# Altium schematic sheet MAC.SchDoc: Grandmaster MAC & Clock Generation
size Tabloid; Author: N Smith; Revision: A; SheetNumber: 6; SheetTotal: 7; Customer: 01910
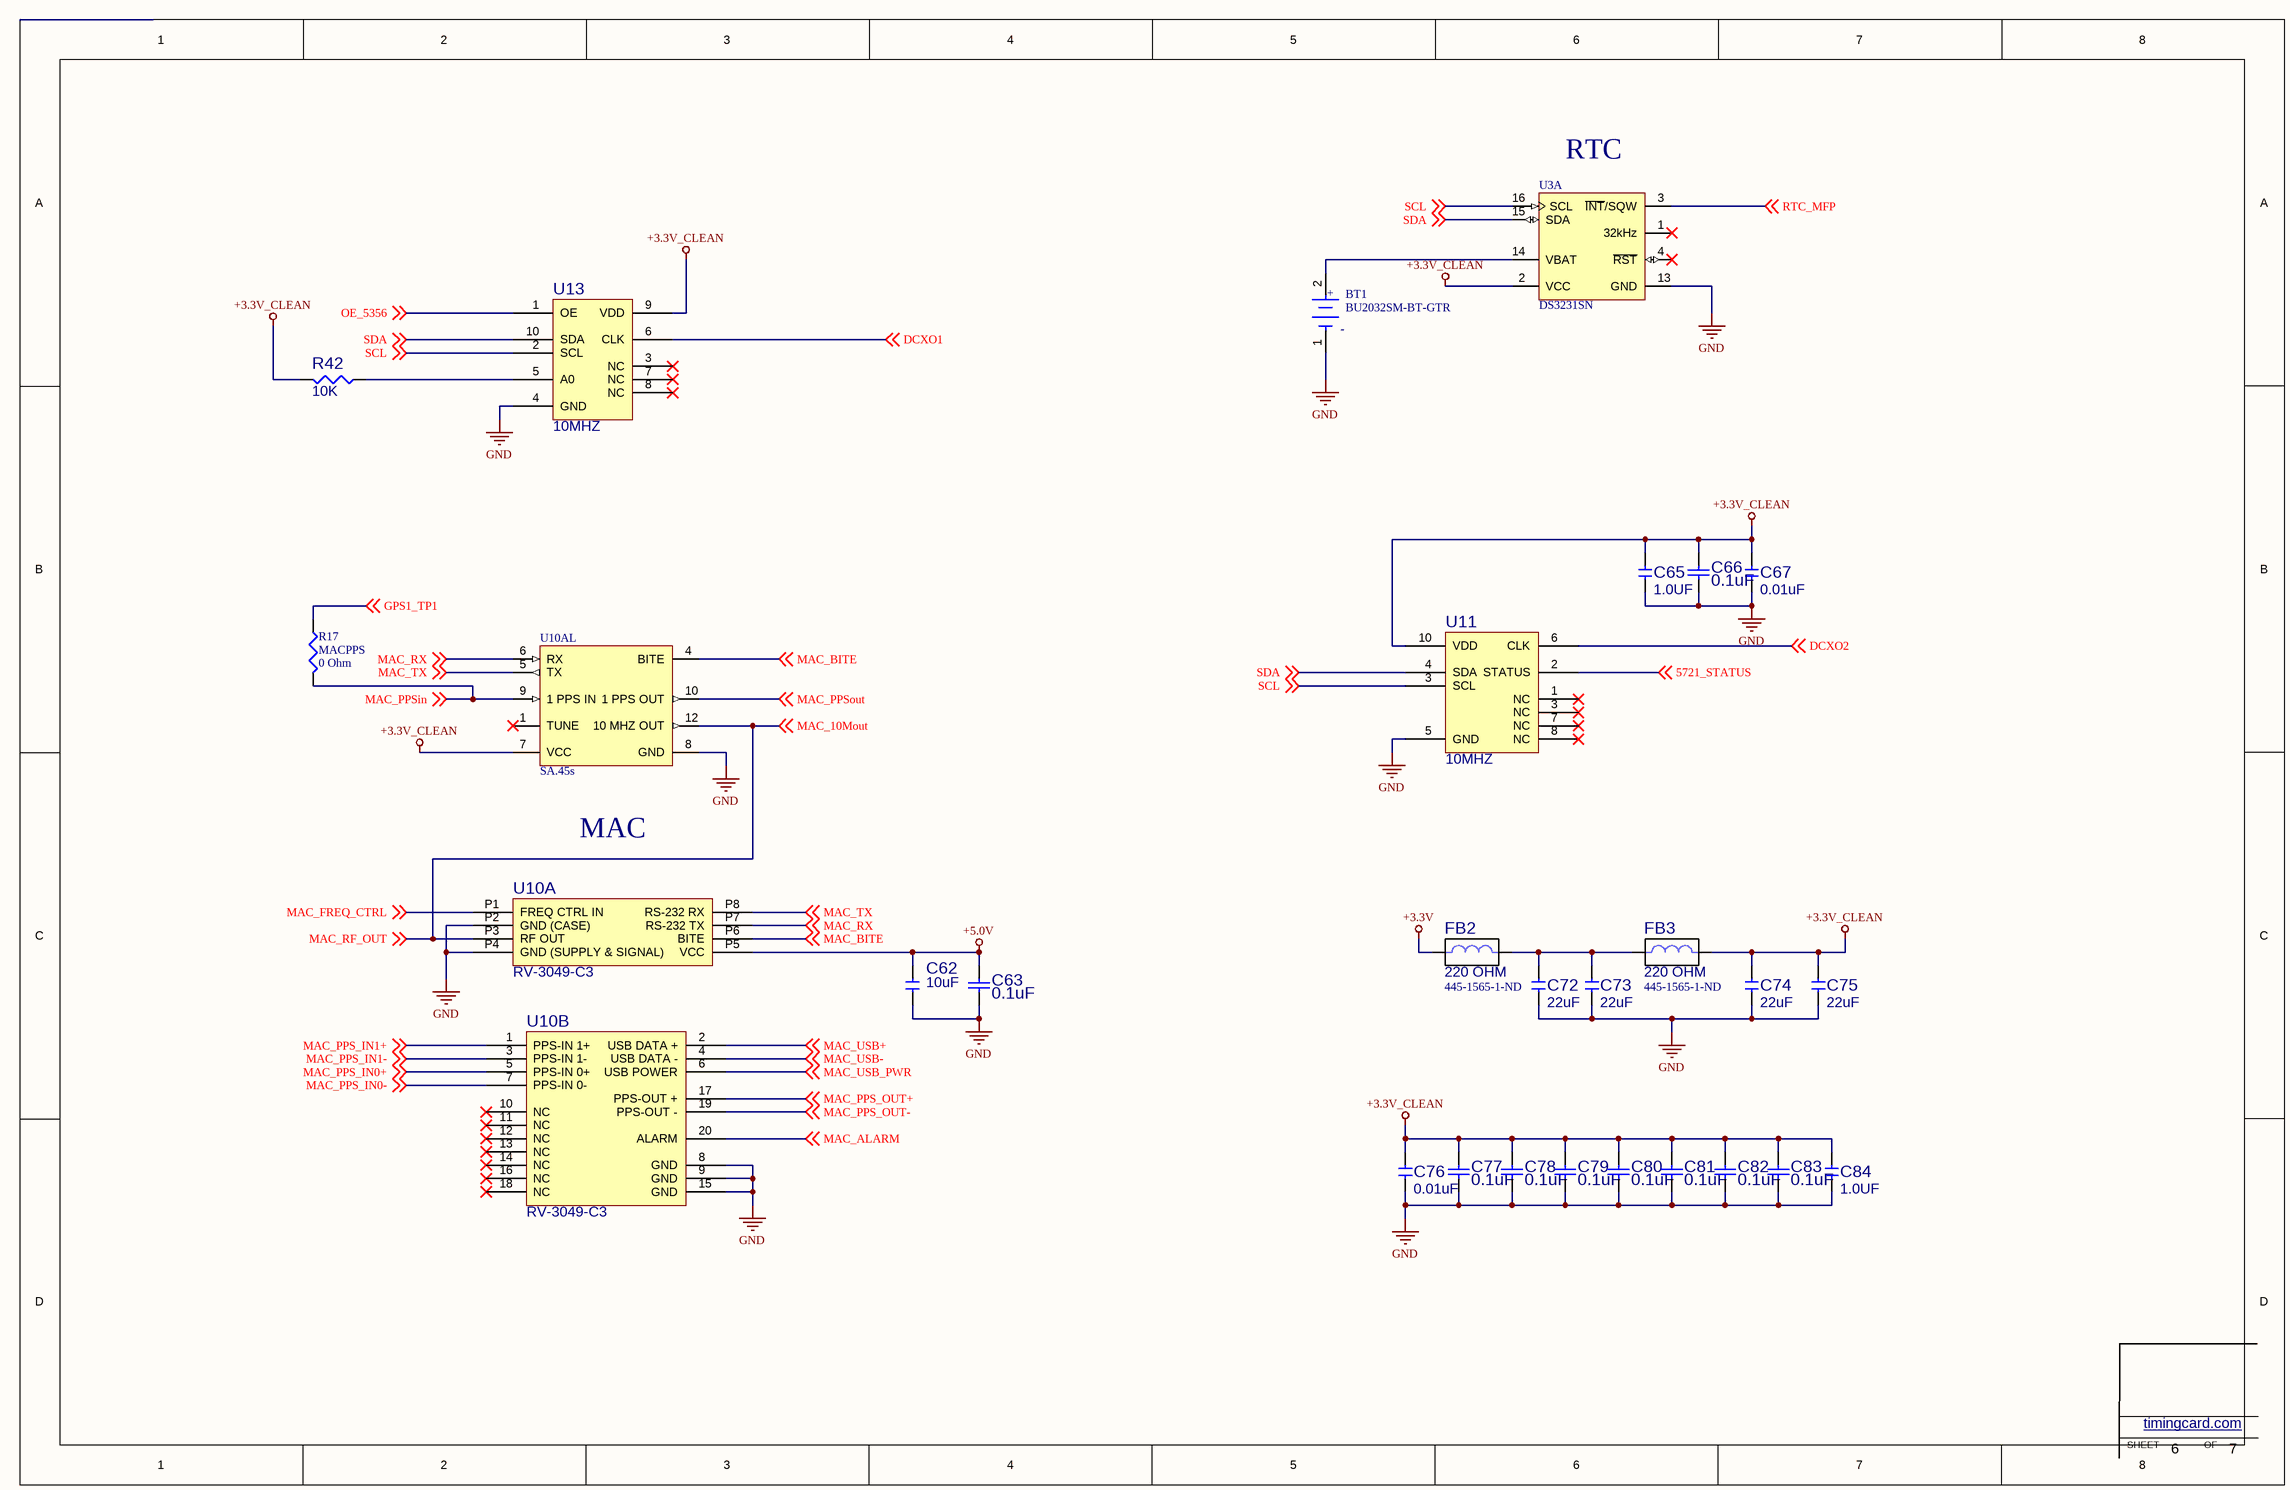
[diagram p0: MAC.SchDoc]

## Parts
BT1  BU2032SM-BT-GTR  [FP-BU2032SM-BT-GTR-MFG]
C62  value 10uF  [CAPC2012X14N]  (hidden comment: CAP_0805_10UF_25V)
C63  0.1uF  [CAPC1608X87X45ML20T05]
C65  value 1.0UF  [CAPC2012X14N]  (hidden comment: CAP_0805_1UF_50V)
C66  0.1uF  [CAPC1608X87X45ML20T05]
C67  value 0.01uF  [CAPC1608X10N]  (hidden comment: CAP_0603_0.01UF_50V)
C72  value 22uF  [CAPC2012X14N]  (hidden comment: CAP_0805_22UF_16V)
C73  value 22uF  [CAPC2012X14N]  (hidden comment: CAP_0805_22UF_16V)
C74  value 22uF  [CAPC2012X14N]  (hidden comment: CAP_0805_22UF_16V)
C75  value 22uF  [CAPC2012X14N]  (hidden comment: CAP_0805_22UF_16V)
C76  value 0.01uF  [CAPC1608X10N]  (hidden comment: CAP_0603_0.01UF_50V)
C77  0.1uF  [CAPC1608X87X45ML20T05]
C78  0.1uF  [CAPC1608X87X45ML20T05]
C79  0.1uF  [CAPC1608X87X45ML20T05]
C80  0.1uF  [CAPC1608X87X45ML20T05]
C81  0.1uF  [CAPC1608X87X45ML20T05]
C82  0.1uF  [CAPC1608X87X45ML20T05]
C83  0.1uF  [CAPC1608X87X45ML20T05]
C84  value 1.0UF  [CAPC2012X14N]  (hidden comment: CAP_0805_1UF_50V)
FB2  value 220 OHM  Supplier Part Number 1: 445-1565-1-ND  [INDC1608X09N]  (hidden comment: MPZ1608_220OHM_0603)
FB3  value 220 OHM  Supplier Part Number 1: 445-1565-1-ND  [INDC1608X09N]  (hidden comment: MPZ1608_220OHM_0603)
R17  MACPPS  value 0 Ohm  [J1-0603]
R42  value 10K  [RESC1608X50N]  (hidden comment: ERJ-3EKF1002V)
U3  DS3231SN  [W16-H2_L]  (part A of 2)
U10  value RV-3049-C3  [MAC-SA5X]  (hidden comment: MAC-SA5X)  (parts A,B of 2)
U10AL  SA.45s  [MCSM-090-02984-00X]
U11  value 10MHZ  [SIT5721]  (hidden comment: SiT5721AI-KWA33-T-10.000000)
U13  value 10MHZ  [SIT5155]  (hidden comment: SiT5356AI-FQA33-IT-10.000000)

## Nets
+3.3V: FB2.1
+3.3V_CLEAN: C65.2 C66.2 C67.2 C74.2 C75.2 C76.2 C77.2 C78.2 C79.2 C80.2 C81.2 C82.2 C83.2 C84.2 FB3.2 R42.2 U3.2(VCC) U10AL.7(VCC) U11.10(VDD) U13.9(VDD)
+5.0V: C62.1 C63.2 U10.P5(VCC)
GND: BT1.1(C) C62.2 C63.1 C65.1 C66.1 C67.1 C72.1 C73.1 C74.1 C75.1 C76.1 C77.1 C78.1 C79.1 C80.1 C81.1 C82.1 C83.1 C84.1 U3.13(GND) U10.8(GND) U10.9(GND) U10.15(GND) U10.P2(GND_(CASE)) U10.P4(GND_(SUPPLY_&_SIGNAL)) U10AL.8(GND) U11.5(GND) U13.4(GND)
5721_STATUS: U11.2(STATUS) ; off-sheet 5721_STATUS
DCXO1: U13.6(CLK) ; off-sheet DCXO1
DCXO2: U11.6(CLK) ; off-sheet DCXO2
GPS1_TP1: R17.1 ; off-sheet GPS1_TP1
MAC_10Mout: U10.P3(RF_OUT) U10AL.12(10_MHZ_OUT) ; off-sheet MAC_RF_OUT, off-sheet MAC_10Mout  [also labelled MAC_RF_OUT]
MAC_ALARM: U10.20(ALARM) ; off-sheet MAC_ALARM
MAC_BITE: U10.P6(BITE) U10AL.4(BITE) ; off-sheet MAC_BITE
MAC_FREQ_CTRL: U10.P1(FREQ_CTRL_IN) ; off-sheet MAC_FREQ_CTRL
MAC_PPS_IN0+: U10.5(PPS-IN_0+) ; off-sheet MAC_PPS_IN0+
MAC_PPS_IN0-: U10.7(PPS-IN_0-) ; off-sheet MAC_PPS_IN0-
MAC_PPS_IN1+: U10.1(PPS-IN_1+) ; off-sheet MAC_PPS_IN1+
MAC_PPS_IN1-: U10.3(PPS-IN_1-) ; off-sheet MAC_PPS_IN1-
MAC_PPS_OUT+: U10.17(PPS-OUT_+) ; off-sheet MAC_PPS_OUT+
MAC_PPS_OUT-: U10.19(PPS-OUT_-) ; off-sheet MAC_PPS_OUT-
MAC_PPSin: R17.2 U10AL.9(1_PPS_IN) ; off-sheet MAC_PPSin
MAC_PPSout: U10AL.10(1_PPS_OUT) ; off-sheet MAC_PPSout
MAC_RX: U10.P7(RS-232_TX) U10AL.6(RX) ; off-sheet MAC_RX
MAC_TX: U10.P8(RS-232_RX) U10AL.5(TX) ; off-sheet MAC_TX
MAC_USB+: U10.2(USB_DATA_+) ; off-sheet MAC_USB+
MAC_USB-: U10.4(USB_DATA_-) ; off-sheet MAC_USB-
MAC_USB_PWR: U10.6(USB_POWER) ; off-sheet MAC_USB_PWR
OE_5356: U13.1(OE) ; off-sheet OE_5356
RTC_MFP: U3.3(~{INT}/SQW) ; off-sheet RTC_MFP
SCL: U3.16(SCL) U11.3(SCL) U13.2(SCL) ; off-sheet SCL
SDA: U3.15(SDA) U11.4(SDA) U13.10(SDA) ; off-sheet SDA
NetBT1_2: BT1.2(A) U3.14(VBAT)
NetC72_2: C72.2 C73.2 FB2.2 FB3.1
NetR42_1: R42.1 U13.5(A0)

Not connected (* = marked no-connect by the designer): U3 1(32kHz)* 4(~{RST})*; U10 10(NC)* 11(NC)* 12(NC)* 13(NC)* 14(NC)* 16(NC)* 18(NC)*; U10AL 1(TUNE)*; U11 1(NC)* 7(NC)* 8(NC)*; U13 3(NC)* 7(NC)* 8(NC)*

## Notes on the sheet
- (near U3) RTC
- MAC
- SHEET
- timingcard.com <http://timingcard.com>
- OF
- (in symbol CMP-136216-000002-1) +; -

## Library data of the parts
BT1 = CMP-136216-000002-1: BATTERY HOLDER COIN 20MM SMD; Number of Cells: 1; Termination: SMD/SMT; Mount: Surface Mount; Max Operating Temperature: 280°C; Min Operating Temperature: -40°C; Package Quantity: 400; Case/Package: SMD/SMT
C62 = CAP_0805_10UF_25V: CAP, CER, 10.UF, 25V, 10%, X5R, 0805; MFG PART NUM: TMK212BBJ106KG-T; VALENTIUM PART NUM: <VALENTIUM>; MFG NAME: TAIYO YUDEN; MAXTEMP: 85C; MINTEMP: -55C; DESC: CAP, CER, 10.UF, 10V, 10%, X5R, 0805; MODIFY DATE: 10/23/2013; CATEGORY: CAP, CER; Date: 4/11/2006 3:37:28 PM; SHEETPART: *; P1: 10%; P2: 25V; P3: X5R; Size: 0805; Supplier 1: MOUSER; Supplier Part Number 1: 963-TMK212BBJ106KG-T
C63 C66 C77-C83 = CMP-2006-00003-1: C0603X104K5RACAUTO; Manufacturer: Kemet; Part Number: C0603X104K5RACAUTO
C65 C84 = CAP_0805_1UF_50V: CAP, CER, 1.0UF, 50V, 10%, X7R, 0805; MFG PART NUM: GCM21BR71H105KA03L; VALENTIUM PART NUM: <VALENTIUM>; MFG NAME: MURATA; MAXTEMP: 125C; MINTEMP: -55C; OTHER: AEC-Q200; MODIFY DATE: 10/23/2013; CATEGORY: CAP, CER; Date: 10/31/2006 2:46:38 PM; SHEETPART: *; P1: 10%; P2: 50V; P3: X7R; Size: 0805; DESC: CAP, CER, 1.0UF, 50V, 10%, X7R, 0805; Supplier 1: Digi-Key; Supplier Part Number 1: 490-10675-1-ND
C67 C76 = CAP_0603_0.01UF_50V: CAP, CER, 0.01UF, 50V, 10%, X7R, 0603; MFG PART NUM: C0603C103K5RACTU; VALENTIUM PART NUM: <VALENTIUM>; MFG NAME: KEMET; MAXTEMP: 125C; MINTEMP: -55C; CATEGORY: CAP, CER; MODIFY DATE: 10/23/2013; Date: 7/24/2013; SHEETPART: *; P1: 10%; P2: 50V; P3: X7R; Size: 0603; Supplier 1: Digi-Key; Supplier Part Number 1: 399-1091-1-ND; DESC: CAP, CER, 0.01UF, 50V, 10%, X7R, 0603
C72-C75 = CAP_0805_22UF_16V: CAP, CER, 22.UF, 16V, 20%, X5R, 0805; MFG PART NUM: GRM219R61C226ME15L; VALENTIUM PART NUM: <VALENTIUM>; MFG NAME: MURATA; MAXTEMP: 85C; MINTEMP: -55C; MODIFY DATE: 10/23/2013; CATEGORY: CAP, CER; Date: 4/11/2006 3:37:28 PM; SHEETPART: *; P1: 20%; P2: 16V; P3: X5R; Size: 0805; DESC: CAP, CER, 22.UF, 16V, 20%, X5R, 0805; Supplier 1: Digi-Key; Supplier Part Number 1: 490-9952-1-ND
FB2 FB3 = MPZ1608_220OHM_0603: FER, 220 OHM, 100MHZ, 2.2A, 0.05OHM DC, MPZ1608, 0603; MFG PART NUM: MPZ1608S221ATA00; VALENTIUM PART NUM: <VALENTIUM>; MFG NAME: TDK CORP; MAXTEMP: 125C; MINTEMP: -55C; MODIFY DATE: 9/4/2013; CATEGORY: FERRITE; Date: 8/6/2013; P1: 100MHZ; P2: 2.2A; P3: 0.05 OHM; SIZE: 0603; SHEETPART: *; DESC: FER, 220 OHM, 100MHZ, 2.2A, 0.05OHM DC, MPZ1608, 0603; OTHER: MPZ1608; Supplier 1: Digi-Key
R17 = Res3: Resistor; Published: 8-Jun-2000; LatestRevisionDate: 29-May-2009; LatestRevisionNote: IPC-7351 Footprint Added.; PackageReference: J1-0603; Publisher: Altium Limited; PackageDescription: Chip Resistor
R42 = RES_0603_10K: RES, 10K, 1%, 1/10W, TF, 0603; VELENTIUM PART NUM: <VELENTIUM>; MFG NAME: PANASONIC; MAXTEMP: 125C; MINTEMP: -55C; OTHER: 100PPM; SUB: GENERIC; ModifyDate: 7/25/2013; MFG PART NUM: ERJ-3EKF1002V; CATEGORY: RES; Date: 7/26/2013; P1: 1%; P3: TF; P2: 1/10W; SIZE: 0603; Supplier 1: Digi-Key; Supplier Part Number 1: P10.0KHCT-ND; SHEETPART: *; DESC: RES, 10K, 1%, 1/10W, TF, 0603
U3 = CMP-0254-00293-1: Extremely Accurate I2C-Integrated Real-Time Clock/TCXO/Crystal, 16-Pin SO, -40 to 85 degC; ComponentLink1Description: Manufacturer URL; ComponentLink3URL: http://pdfserv.maxim-ic.com/package_dwgs/21-0042.PDF; ComponentLink3Description: Package Specification; PackageVersion: revD, 2010; ComponentLink2URL: http://datasheets.maxim-ic.com/en/ds/DS3231.pdf; ComponentLink2Description: Datasheet; PackageReference: W16-H2; Code_JEDEC: MS-013-AA; ComponentLink1URL: http://www.maxim-ic.com; PackageDescription: 16-Pin Small-Outline IC, Wide (0.3in), 1.27 mm Pitch, SOIC (W); Code_IPC: SOIC127P1030-16; DatasheetVersion: Rev 8, Jul-2010
U10 = MAC-SA5X: MOD, MAC, MAC-SA5X, ATOMIC CLOCK; VELENTIUM PART NUM: <V PART NUM>; MFG NAME: MICROCHIP; MAXTEMP: 85C; MINTEMP: -40C; OTHER: AEC-Q200; MODIFY DATE: 3/22/2006 1:36:44 PM; MFG PART NUM: MAC-SA5X; CATEGORY: MOD; P1: ATOMIC CLOCK; SHEETPART: *; DESC: MOD, MAC, MAC-SA5X, ATOMIC CLOCK
U10AL = CMP-2000-07612-1: Quantum(TM) Miniature Chip Scale Atomic Clock, 3.3 V, 10 MHz, -10 to 70 degC, 9-Pin THD, RoHS, Bulk; Manufacturer: Microsemi; Package Description: 9-Pin Through Hole Device, Body 40.64 x 35.306 mm; Manufacturer URL: http://www.microsemi.com/; Datasheet Version: 03/2017; Package Reference: 090-02984-00X; Datasheet URL: https://media.digikey.com/pdf/Data%20Sheets/Microsemi%20PDFs/090-02984-001.pdf; Mounting Technology: ThroughHole
U11 = SiT5721AI-KWA33-T-10.000000: OSC, 10MHZ, 3.3V, 5PPB, DCOCXO, SMT; VELENTIUM PART NUM: <V PART NUM>; MFG NAME: SITIME; MAXTEMP: 85C; MINTEMP: -30C; MFG PART NUM: SiT5721AI-KWA33-T-10.000000; MODIFY DATE: 9/18/2013; CATEGORY: OSC; Date: 9/18/2013; P1: OSC; P2: 3.3V; P3: 5PPB; SIZE: 9.0X7.0MM; SHEETPART: *; DESC: OSC, 10MHZ, 3.3V, 5PPB, DCOCXO, SMT
U13 = SiT5356AI-FQA33-IT-10.000000: OSC, 10MHZ, 3.3V, 100PPB, DCTCXO, SMT; VELENTIUM PART NUM: <V PART NUM>; MFG NAME: SITIME; MAXTEMP: 85C; MINTEMP: -30C; MFG PART NUM: SiT5356AI-FQA33-IT-10.000000; MODIFY DATE: 9/18/2013; CATEGORY: OSC; Date: 9/18/2013; P1: OSC; P2: 3.3V; P3: 100PPB; SIZE: 5.0X3.2MM; SHEETPART: *; DESC: OSC, 10MHZ, 3.3V, 100PPB, DCTCXO, SMT